# Altium project MCont_V1.0.PrjPcb (part 1 of 2)
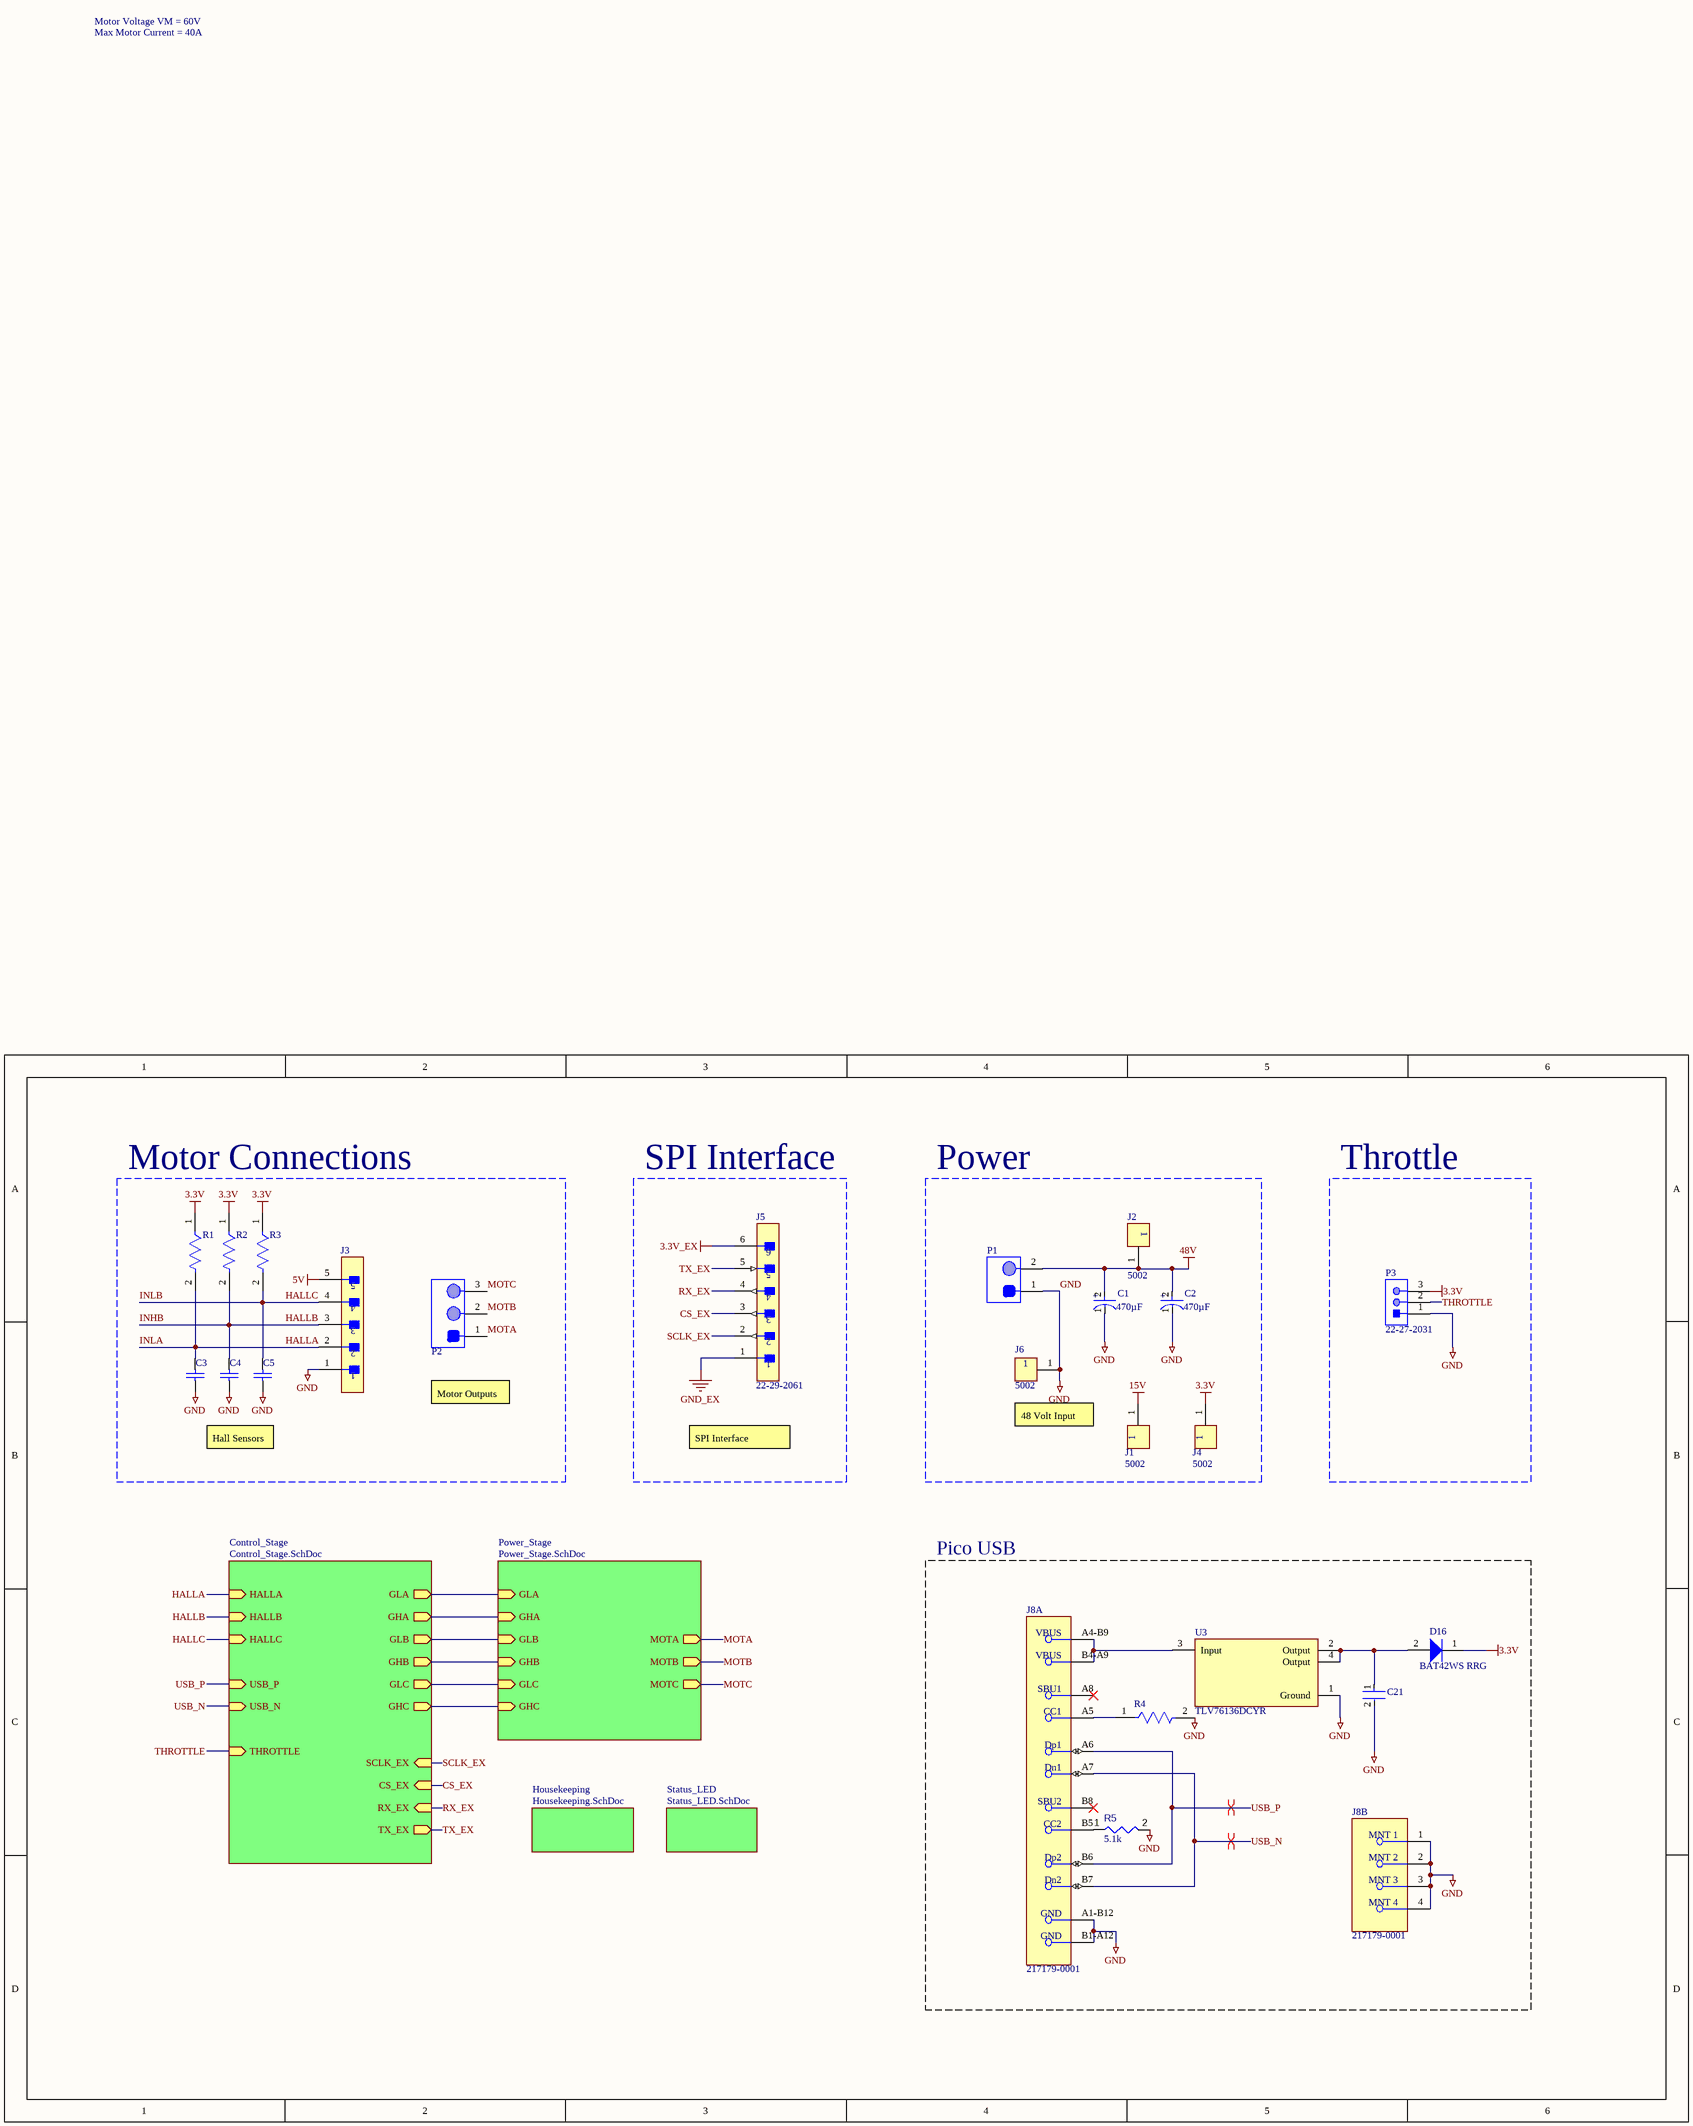
[diagram p0: MCont_V1.0.SchDoc]
5 sheets, 146 parts. Net scope: hierarchical (ports join the sheet entries above them; power ports are global).
Board file: MCont_V1.0.PcbDoc
Sheets:
  MCont_V1.0.SchDoc
    Housekeeping = Housekeeping.SchDoc
    Status_LED = Status_LED.SchDoc
    Power_Stage = Power_Stage.SchDoc
    Control_Stage = Control_Stage.SchDoc

## Sheet MCont_V1.0.SchDoc
size 381 x 241 mm; SheetNumber: 1; SheetTotal: 5

### Parts
C1  Capacitance: 470µF  [FP-ESH477M100AM2AA-MFG]  (hidden comment: ESH477M100AM2AA)
C2  Capacitance: 470µF  [FP-ESH477M100AM2AA-MFG]  (hidden comment: ESH477M100AM2AA)
C3  VJ0603Y102KXACW1BC  [CAPC1608X95X40NL15T15]  (value not drawn)
C4  VJ0603Y102KXACW1BC  [CAPC1608X95X40NL15T15]  (value not drawn)
C5  VJ0603Y102KXACW1BC  [CAPC1608X95X40NL15T15]  (value not drawn)
C21  CC0603KRX5R6BB106  [FP-CC0603-DC-MFG]  (value not drawn)
D16  BAT42WS RRG  [BAT42WS RRG-Footprint-1]
J1  5002  [FP-5002-MFG]
J2  5002  [FP-5002-MFG]
J3  22-29-2051  [FP-22-29-2051-MFG]  (value not drawn)
J4  5002  [FP-5002-MFG]
J5  22-29-2061  [FP-22-29-2061-MFG]
J6  5002  [FP-5002-MFG]
J8  217179-0001  [FP-2171790001-MFG]  (parts A,B of 2)
P1  VP0265540000G  [VP0265540000G-Footprint-1]  (value not drawn)
P2  VP0365540000G  [VP0365540000G-Footprint-1]  (value not drawn)
P3  22-27-2031  [MOLX-22-27-2031_V]
R1  RC0603FR-0710KL  [FP-RC0603-0_55-IPC_C]  (value not drawn)
R2  RC0603FR-0710KL  [FP-RC0603-0_55-IPC_C]  (value not drawn)
R3  RC0603FR-0710KL  [FP-RC0603-0_55-IPC_C]  (value not drawn)
R4  ERJ-3EKF5101V  [FP-ERJ3EK-MFG]  (value not drawn)
R5  value 5.1k  [FP-ERJ3EK-IPC_A]  (hidden comment: ERJ-3EKF5101V)
U3  TLV76136DCYR  [TLV76136DCYR-Footprint-1]

### Blocks framed on the sheet
Motor Connections: C3-C5 J3 P2 R1-R3
SPI Interface: J5
Power: C1 C2 J1 J2 J4 J6 P1
Throttle: P3
Pico USB: C21 D16 J8 R4 R5 U3

### Sub-sheets
Control_Stage = Control_Stage.SchDoc: HALLA (in), HALLB (in), HALLC (in), USB_P (in), USB_N (in), GLA (out), GHA (out), GLB (out), GHB (out), GLC (out), GHC (out), THROTTLE (in), SCLK_EX (in), CS_EX (in), RX_EX (in), TX_EX (out)
Housekeeping = Housekeeping.SchDoc: no entries
Power_Stage = Power_Stage.SchDoc: MOTA (out), MOTB (out), MOTC (out), GLA (in), GHA (in), GLB (in), GHB (in), GLC (in), GHC (in)
Status_LED = Status_LED.SchDoc: no entries

### Nets
3.3V: D16.1(K) J4.1 P3.3 R1.1 R2.1 R3.1
3.3V_EX: J5.6
5V: J3.5
15V: J1.1
48V: C1.2(A) C2.2(A) J2.1 P1.2
GND: C1.1(C) C2.1(C) C3.1 C4.1 C5.1 C21.2 J3.1 J6.1 J8.1(MNT_1) J8.2(MNT_2) J8.3(MNT_3) J8.4(MNT_4) J8.A1-B12(GND) J8.B1-A12(GND) P1.1 P3.1 R4.2 R5.2 U3.1(Ground)
GND_EX: J5.1
CS_EX: J5.3 ; sheet Control_Stage/CS_EX
GHA: sheet Power_Stage/GHA, sheet Control_Stage/GHA
GHB: sheet Power_Stage/GHB, sheet Control_Stage/GHB
GHC: sheet Power_Stage/GHC, sheet Control_Stage/GHC
GLA: sheet Power_Stage/GLA, sheet Control_Stage/GLA
GLB: sheet Power_Stage/GLB, sheet Control_Stage/GLB
GLC: sheet Power_Stage/GLC, sheet Control_Stage/GLC
HALLA: C3.2 J3.2 R1.2 ; sheet Control_Stage/HALLA  [also labelled INLA]
HALLB: C4.2 J3.3 R2.2 ; sheet Control_Stage/HALLB  [also labelled INHB]
HALLC: C5.2 J3.4 R3.2 ; sheet Control_Stage/HALLC  [also labelled INLB]
MOTA: P2.1 ; sheet Power_Stage/MOTA
MOTB: P2.2 ; sheet Power_Stage/MOTB
MOTC: P2.3 ; sheet Power_Stage/MOTC
RX_EX: J5.4 ; sheet Control_Stage/RX_EX
SCLK_EX: J5.2 ; sheet Control_Stage/SCLK_EX
THROTTLE: P3.2 ; sheet Control_Stage/THROTTLE
TX_EX: J5.5 ; sheet Control_Stage/TX_EX
USB_N: J8.A7(Dn1) J8.B7(Dn2) ; sheet Control_Stage/USB_N
USB_P: J8.A6(Dp1) J8.B6(Dp2) ; sheet Control_Stage/USB_P
NetC21_1: C21.1 D16.2(A) U3.2(Output) U3.4(Output)
NetJ8_A4-B9: J8.A4-B9(VBUS) J8.B4-A9(VBUS) U3.3(Input)
NetJ8_A5: J8.A5(CC1) R4.1
NetJ8_B5: J8.B5(CC2) R5.1

Not connected (* = marked no-connect by the designer): J8 A8(SBU1)* B8(SBU2)*

### Layout directives
differential pair: USB_N, USB_P

### Notes on the sheet
- Motor Voltage VM = 60V
- Max Motor Current = 40A
- Motor Outputs
- Hall Sensors
- SPI Interface
- 48 Volt Input
- (in symbol CMP-00212-26722299-1) +

### Library data of the parts
C1 C2 = CMP-00212-26722299-1: ESH477M100AM2AA Radial Can ALUMINUM ELECTROLYTIC CAPACITOR ESH 100V 470muF ±20% 0.630Dia 16.00mm; Life (Hours): 2000hours; Case/Package: Radial; Height: 32mm; REACH SVHC: No SVHC; Voltage Rating: 100V; Min Operating Temperature: -25°C; Diameter: 16mm; Voltage Rating (DC): 100V; Max Operating Temperature: 105°C; RoHS: Compliant; Packaging: Tape & Reel; Tolerance: 20%; Lead Pitch: 7.5mm; NexarPartId: 26722299
C3-C5 = CMP-2006-02121-1: Manufacturer: Vitramon; Part Number: VJ0603Y102KXACW1BC
C21 = CMP-03422-001507-1: CAP CER 10UF 10V X5R 0603; Tolerance: 10%; Case/Package: 0603; Length: 0.063inch; Capacitance: 10uF; Dielectric: X5R; Mount: Surface Mount; Case Code (Metric): 1608; Depth: 0.8mm; Voltage Rating (DC): 10V; Voltage Rating: 10V; Lead Free: Lead Free; Resistor Type: Ceramic; Packaging: Tape and Reel; Max Operating Temperature: 85°C; Termination: SMD/SMT; Min Operating Temperature: -55°C; Weight: 7.1E-05oz; Thickness: 0.035inch; Case Code (Imperial): 0603; Package Quantity: 4000; Halogen Free: Halogen Free; RoHS Compliant: Yes; Width: 0.031inch
D16 = CMP-004-00032-1: Schottky Diode, 30V, 0.2A, Sod-323F Rohs Compliant: Yes; Manufacturer Lifecycle Status: ACTIVE; Lifecycle Status: Production
J1 J2 J4 J6 = CMP-2000-05182-2: PC TEST POINT MINIATURE WHITE; Body Material: Bronze; Insulation: Insulated; Inside Diameter: 1.27mm; Number of Ports: 1; Outside Diameter: 2.54mm; Hole Diameter: 1.6mm; Plating: Silver; Contact Plating: Silver; Orientation: Straight; REACH SVHC: No SVHC; Series: THM; Packaging: Bulk; Material: Nylon; Flammability Rating: UL94 V-0; Mount: Through Hole; Color: White; Housing Color: White; Length: 7.62mm; Contact Material: Bronze; Lead Free: Lead Free; Package Quantity: 100; RoHS Compliant: Yes
J3 = CMP-04776-000816-1: 2.54MM KK HDR VT FRICLK VRA .5AU; Number of Circuits: 5; Connector Type: Male Pin; Max Current Rating: 7A; Glow Wire Compliant: Non-compliant; Insulation Resistance: 50GR; Gender: Male; Current Rating: 4A; Number of Lines: 1; Max Voltage Rating (AC): 250V; Contact Resistance: 10mR; Orientation: Straight; Height: 14.73mm; Contact Plating: Gold; Series: KK® 6410; Number of Poles: 5; Mount: Through Hole; Length: 12.7mm; Packaging: Bulk; Package Quantity: 10; Depth: 5.8mm; Housing Color: White; Pitch: 2.54mm; Number of Positions: 5; Contact Mating Length: 0.295inch; Max Operating Temperature: 75°C; Housing Material: Nylon; Termination: Solder; Contact Material: Brass; Flammability Rating: UL94 V-0; Number of Contacts: 5; Color: Natural; Min Operating Temperature: 0°C; Radiation Hardening: No; Contact Type: Male Pin; Number of Rows: 1; Voltage Rating: 250V; Voltage Rating (DC): 250V; Contact Gender: Male; Fastening Type: Friction; Lead Free: Lead Free; Halogen Free: Low Halogen
J5 = CMP-04776-000348-1: CONN HEADER VERT 6POS 2.54MM; Gender: Male; Number of Poles: 6; Voltage Rating: 250V; Insulation Resistance: 50GR; Contact Resistance: 10mR; Current Rating: 4A; Number of Lines: 1; Height: 11.7mm; Mount: Through Hole; Length: 15.24mm; Contact Plating: Gold; Contact Type: Male Pin; Contact Material: Brass; Housing Material: Nylon; Series: KK® 6410; Number of Positions: 6; Contact Mating Length: 0.295inch; Fastening Type: Friction; RoHS Compliant: Yes; Color: Natural; Max Operating Temperature: 75°C; Contact Gender: Male; Packaging: Bulk; Termination: Solder; Voltage Rating (DC): 250V; Orientation: Straight; Radiation Hardening: No; Flammability Rating: UL94 V-0; Package Quantity: 1000; Housing Color: White; Number of Rows: 1; Min Operating Temperature: 0°C; Max Current Rating: 4A; Pitch: 2.54mm; Depth: 5.8mm; Number of Contacts: 6; Lead Free: Lead Free
J8 = CMP-04767-000028-2: CONN RCP USB2.0 TYP C 24P SMD RA; NexarPartId: 117190526; Gender: Receptacle; Number of Contacts: 16; Current Rating: 1.25A; Voltage Rating: 30V; Min Operating Temperature: -40°C; USB Standard: USB 2.0; Height: 3.36mm; Contact Material: Gold, Nickel; Max Operating Temperature: 85°C
P1 = CMP-002-00073-1: VP10.16-2P slot screws Cr3+ zinc, solder foot bright tin, steel stamping clamp; RoHS Compliant: Yes
P2 = CMP-002-00077-2: VP10.16-3P slot screws Cr3 zinc, solder foot bright tin, steel stamping clamp; RoHS Compliant: Yes
P3 = CMP-2000-05538-1: Male Header, Pitch 2.54 mm, 1 x 3 Position, Height 11.7 mm, Tail Length 3.56 mm, -40 to 80 degC, RoHS, Bulk; Manufacturer: Molex; Voltage rating: 250V; Current rating: 4A; Package Reference: 22-27-2031; Housing material: Nylon(UL94V-0); Operating temperature: 0°Cto+75°C; Package Description: Male Header, Pitch 2.54 mm, 1 x 3 Position, Height 11.7 mm, Tail Length 3.56 mm; Package URL: http://www.molex.com/pdm_docs/sd/022272031_sd.pdf; Datasheet Version: 06/2016; Manufacturer URL: http://www.molex.com/; Mounting Technology: ThroughHole; Datasheet URL: http://www.molex.com/webdocs/datasheets/pdf/en-us/0022272031_PCB_HEADERS.pdf; Contact material: Tinplatedbrass
R1-R3 = CMP-2100-03664-2: RES 10K OHM 1% 1/10W 0603; Voltage Rating: 75V; Voltage Rating (DC): 50V; Resistance: 10kR; Power Rating: 100mW; Temperature Coefficient: 100ppm/°C; Depth: 0.8mm; Termination: SMD/SMT; Resistor Type: Thick Film; Series: RC; Construction: Rectangular; Features: Moisture Resistant; Packaging: Tape and Reel; Min Operating Temperature: -55°C; Number of Terminations: 2; Lead Pitch: 0.3mm; RoHS Compliant: Yes; Case/Package: 0603; Resistance Tolerance: 1%; Military Standard: Not; Weight: 7.1E-05oz; Number of Pins: 2; Tolerance: 1%; Length: 1.6mm; Case Code (Imperial): 0603; Lead Free: Lead Free; Width: 0.8mm; Max Power Dissipation: 100mW; Height: 0.45mm; Max Operating Temperature: 155°C; Case Code (Metric): 1608; Size Code: 0603
R4 = CMP-2000-00540-8: RES SMD 5.1K OHM 1% 1/10W 0603; Power Rating: 100mW; Temperature Coefficient: 100ppm/°C; Voltage Rating: 75V; Resistance: 5.1kR; Military Standard: Not; Case/Package: 0603; Packaging: Tape and Reel; Package Quantity: 1; Reach SVHC Compliant: Yes; Lead Free: Lead Free; Mount: Surface Mount; Size Code: 0603; Depth: 0.8mm; Resistance Tolerance: 1%; Number of Terminations: 2; Resistor Type: Thick Film; Width: 0.8mm; Construction: Rectangular; Series: ERJ; Radiation Hardening: No; Max Operating Temperature: 155°C; Features: Automotive AEC-Q200; Tolerance: 1%; Voltage Rating (DC): 75V; Length: 1.6mm; RoHS Compliant: Yes; Min Operating Temperature: -55°C; Case Code (Metric): 1608; Termination: SMD/SMT; Weight: 7.1E-05oz; Max Power Dissipation: 100mW; Contact Plating: Tin; Height: 0.022inch; Case Code (Imperial): 0603
R5 = CMP-009-00178-1: Fixed Resistor, Metal Glaze/thick Film, 0.1W, 5100ohm, 75V, 1% +/-Tol, 100ppm/Cel, Surface Mount, 0603; Power: 100mW; Case/Package: 0603; Tolerance: 1%; Min Operating Temperature: -55°C; Max Operating Temperature: 155°C; RoHS Compliant: Yes; Mounting Technology: Surface Mount; Pins: 2
U3 = CMP-019-00054-3: 1A 16V high-PSRR linear voltage regulator 4-SOT-223 -40 to 125; Manufacturer Lifecycle Status: ACTIVE; Length: 6.5mm; RoHS: Compliant; Thickness: 1.6mm; Width: 3.5mm; Case/Package: SOT-223; Lifecycle Status: Production; Pins: 4; Height: 1.8mm

## Sheet Housekeeping.SchDoc
size B; SheetNumber: 2; SheetTotal: 5
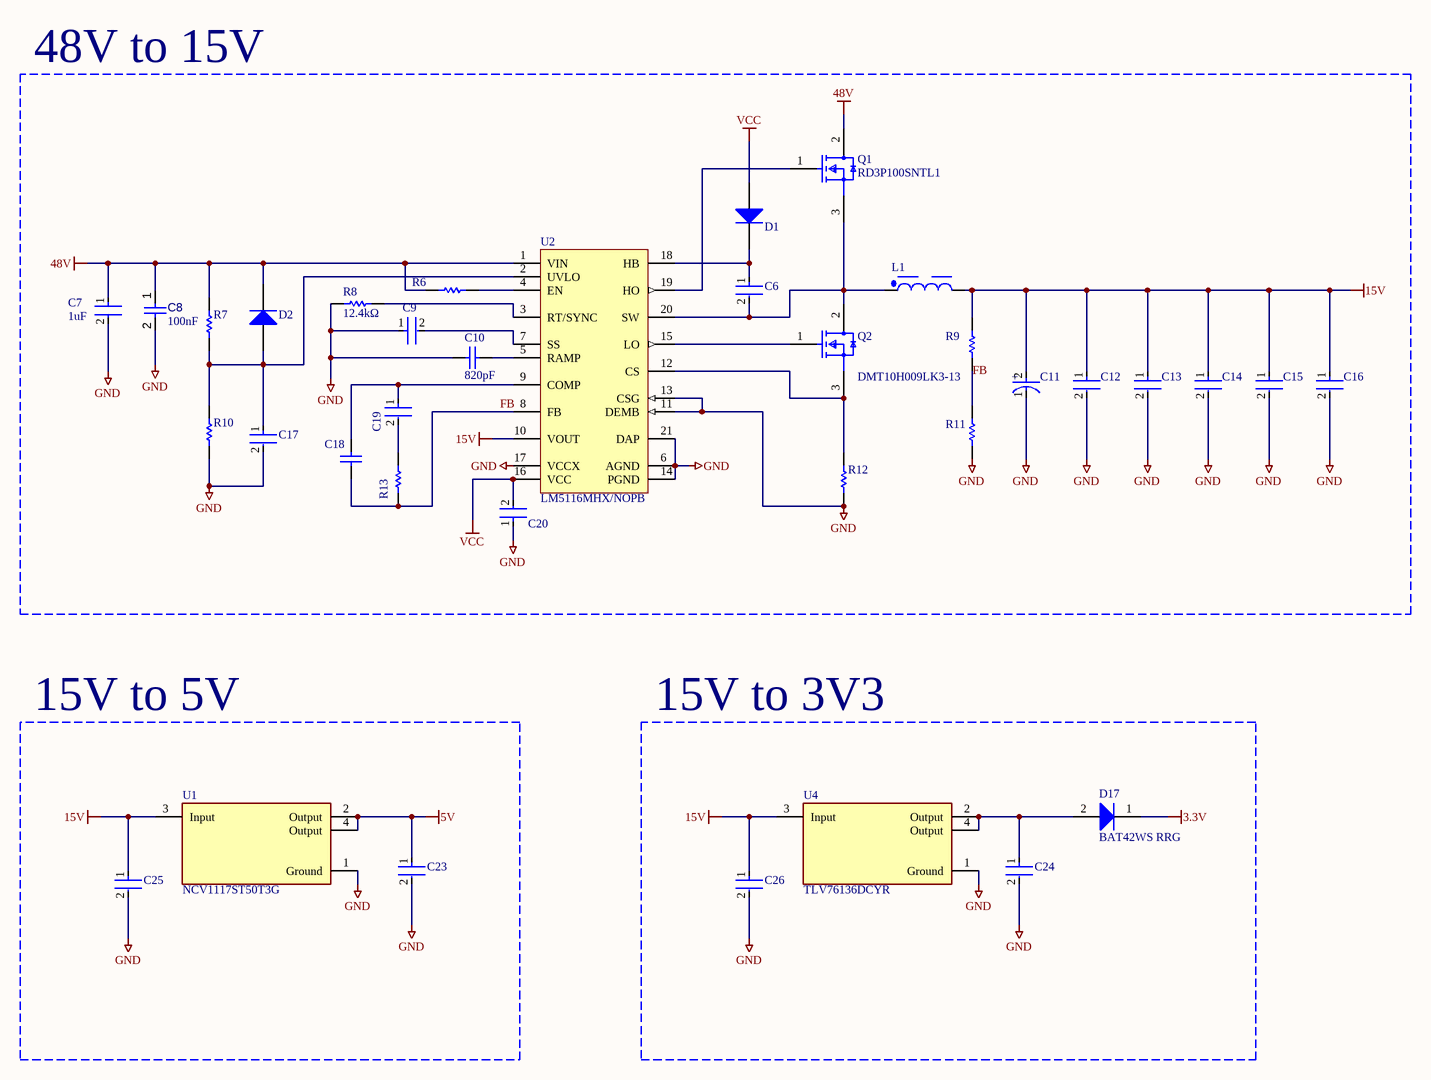
[diagram p1: Housekeeping.SchDoc]

### Parts
C6  UMK107AB7105KA-T  [FP-0603-L_1_6_0_15-W_0_8-IPC_C]  (value not drawn)
C7  Capacitance: 1uF  [FP-C1210C105K1RACTU-MFG]  (hidden comment: C1210C105K1RACTU)
C8  value 100nF  [FP-CL10-IPC_B]  (hidden comment: CL10B104KC8NNNC)
C9  CL10B104KC8NNNC  [FP-CL10-IPC_A]  (value not drawn)
C10  value 820pF  [0603N821J500CT-Footprint-1]  (hidden comment: 0603N821J500CT)
C11  50SVPF10M  [FP-OS-CON-SMT-C6-MFG]  (value not drawn)
C12  CL31A106KBHNNNE  [FP-CL31-IPC_C]  (value not drawn)
C13  CL31A106KBHNNNE  [FP-CL31-IPC_C]  (value not drawn)
C14  CL31A106KBHNNNE  [FP-CL31-IPC_C]  (value not drawn)
C15  CL31A106KBHNNNE  [FP-CL31-IPC_C]  (value not drawn)
C16  CL31A106KBHNNNE  [FP-CL31-IPC_C]  (value not drawn)
C17  UMK107AB7105KA-T  [FP-0603-L_1_6_0_15-W_0_8-IPC_C]  (value not drawn)
C18  CC0603JRNPO9BN101  [CAPC1608X90X40ML10T20]  (value not drawn)
C19  C0603C332J5RACTU  [FP-C0603C-CF-MFG]  (value not drawn)
C20  UMK107AB7105KA-T  [FP-0603-L_1_6_0_15-W_0_8-IPC_C]  (value not drawn)
C23  CC0603KRX5R6BB106  [FP-CC0603-DC-MFG]  (value not drawn)
C24  CC0603KRX5R6BB106  [FP-CC0603-DC-MFG]  (value not drawn)
C25  UMK107AB7105KA-T  [FP-0603-L_1_6_0_15-W_0_8-IPC_C]  (value not drawn)
C26  UMK107AB7105KA-T  [FP-0603-L_1_6_0_15-W_0_8-IPC_C]  (value not drawn)
D1  LL4148  [FAIR-SOD80-2_V]  (value not drawn)
D2  LL4148  [FAIR-SOD80-2_V]  (value not drawn)
D17  BAT42WS RRG  [BAT42WS RRG-Footprint-1]
L1  7447709390  [WE-PD_1210]  (value not drawn)
Q1  RD3P100SNTL1  [DPAK230P990X240-3N]
Q2  DMT10H009LK3-13  [DPAK229P991X239-3N]
R6  RC0603FR-071ML  [RESC1608X55X25LL10T15]  (value not drawn)
R7  ERJ-3EKF6192V  [RESC1608X55X30ML15T15]  (value not drawn)
R8  value 12.4kΩ  [FP-RC0603-0_55-IPC_C]  (hidden comment: RC0603FR-0712K4L)
R9  RC0603FR-0716K2L  [RESC1608X55X25NL10T15]  (value not drawn)
R10  ERJ-3EKF3921V  [RESC1608X55X30LL15T15]  (value not drawn)
R11  ERJ-3EKF1431V  [RESC1608X55X30ML15T15]  (value not drawn)
R12  ERJ8CWFR024V  [RESC3216X70X50NL05T20]  (value not drawn)
R13  ERJ3EKF1802V  [RESC1608X55X30LL15T15]  (value not drawn)
U1  NCV1117ST50T3G  [NCV1117ST50T3G-Footprint-1]
U2  LM5116MHX/NOPB  [PWP0020A_M]
U4  TLV76136DCYR  [TLV76136DCYR-Footprint-1]

### Blocks framed on the sheet
48V to 15V: C6-C20 D1 D2 L1 Q1 Q2 R6-R13 U2
15V to 5V: C23 C25 U1
15V to 3V3: C24 C26 D17 U4

### Nets
3.3V: D17.1(K)
5V: C23.1 U1.2(Output) U1.4(Output)
15V: C11.2(A) C12.1 C13.1 C14.1 C15.1 C16.1 C25.1 C26.1 L1.2 R9.2 U1.3(Input) U2.10(VOUT) U4.3(Input)
48V: C7.1 C8.1 D2.2(K) Q1.2 R6.1 R7.2 U2.1(VIN)
GND: C7.2 C8.2 C9.1 C10.1 C11.1(C) C12.2 C13.2 C14.2 C15.2 C16.2 C17.2 C20.1 C23.2 C24.2 C25.2 C26.2 R8.1 R10.1 R11.1 R12.1 U1.1(Ground) U2.6(AGND) U2.11(DEMB) U2.13(CSG) U2.14(PGND) U2.17(VCCX) U2.21(DAP) U4.1(Ground)
VCC: C20.2 D1.1(A) U2.16(VCC)
FB: C18.1 R9.1 R11.2 R13.1 U2.8(FB)
NetC6_1: C6.1 D1.2(K) U2.18(HB)
NetC6_2: C6.2 L1.1 Q1.3 Q2.2(D) U2.20(SW)
NetC9_2: C9.2 U2.7(SS)
NetC10_2: C10.2 U2.5(RAMP)
NetC17_1: C17.1 D2.1(A) R7.1 R10.2 U2.2(UVLO)
NetC18_2: C18.2 C19.1 U2.9(COMP)
NetC19_2: C19.2 R13.2
NetC24_1: C24.1 D17.2(A) U4.2(Output) U4.4(Output)
NetQ1_1: Q1.1(Gate) U2.19(HO)
NetQ2_1: Q2.1(G) U2.15(LO)
NetQ2_3: Q2.3(S) R12.2 U2.12(CS)
NetR6_2: R6.2 U2.4(EN)
NetR8_2: R8.2 U2.3(RT/SYNC)

### Notes on the sheet
- (in symbol CMP-05428-000804-1) +

### Library data of the parts
C6 C17 C20 C25 C26 = CMP-2000-07531-4: Ceramic Capacitor General Use 1uF ±10% 50V X7R 0603; Series: M; Width: 0.031inch; Mount: Surface Mount; Radiation Hardening: No; Voltage Rating (DC): 50V; Packaging: Tape and Reel; Termination: SMD/SMT; Depth: 0.8mm; Case Code (Metric): 1608; Case Code (Imperial): 0603; Height: 0.8mm; Voltage Rating: 50V; Package Quantity: 1; Halogen Free: Halogen Free; Dielectric: X7R; Min Operating Temperature: -55°C; Length: 1.6mm; Construction: Flat; Tolerance: 10%; Thickness: 0.037inch; Max Operating Temperature: 125°C; Case/Package: 0603; Capacitance: 1uF; RoHS Compliant: Yes
C7 = CMP-03020-034669-1: CAP CER 1UF 100V X7R 1210; Dielectric Material: Ceramic; Tolerance: 10%; Height: 1.7mm; Voltage Rating: 100V; Termination: SMD/SMT; Depth: 2.5mm; Construction: Flat; REACH SVHC: No SVHC; Length: 3.2mm; Case Code (Imperial): 1210; Radiation Hardening: No; Case/Package: 1210; Case Code (Metric): 3225; Mount: Surface Mount; Package Quantity: 1; Voltage Rating (DC): 100V; Min Operating Temperature: -55°C; Voltage: 100V; Thickness: 0.075inch; Width: 0.098inch; Max Operating Temperature: 125°C; Packaging: Tape and Reel; Series: C; RoHS Compliant: Yes; Number of Pins: 2; Dielectric: X7R
C8 = CMP-001-00090-1: Ceramic Capacitor, Multilayer, Ceramic, 100V, 10% +Tol, 10% -Tol, X7R, 15% TC, 0.1uF, Surface Mount, 0603; Case/Package: 0603; Min Operating Temperature: -55°C; Mounting Technology: Surface Mount; Capacitor Type: Ceramic; Max Operating Temperature: 125°C; Pins: 2; RoHS Compliant: Yes
C9 = CMP-13271-004036-1: Cap Ceramic 100nF 100V X7R ±10% Pad SMD 0603 +125°C T/R; Mount: Surface Mount; Packaging: Cut Tape; Width: 0.031inch; Thickness: 0.035inch; Length: 0.063inch; Tolerance: 10%; Min Operating Temperature: -55°C; Case/Package: 0603; Voltage Rating: 100V; Max Operating Temperature: 125°C; Case Code (Metric): 1608; Capacitance: 100nF; Case Code (Imperial): 0603
C10 = CMP-001-00084-2: 0603 Cap Ceramic 820pF 50V C0G 5% - Multilayer Ceramic Capacitors; Tolerance: 5%; Mounting Technology: Surface Mount; Max Operating Temperature: 125°C; Length: 1.6mm; Height: 800µm; Case/Package: 0603; Case Code (Imperial): 0603; Case Code (Metric): 1608; Number of Terminals: 2; Voltage Rating: 50V; Voltage Rating (DC): 50V; Dielectric: C0G; Radiation Hardening: No; Min Operating Temperature: -55°C; Dielectric Material: Ceramic; REACH SVHC: Yes; Lifecycle Status: Production; China RoHS: Compliant; Width: 800µm; RoHS: Compliant; Lead Free: Lead Free; Depth: 800µm
C11 = CMP-05428-000804-1: Conductive Polymer Aluminum Solid Capacitors (OS-CON) 10uF ±20% 50V; ESR (Equivalent Series Resistance): 40mR; Ripple Current: 2.5A; Leakage Current: 100uA; Life (Hours): 5000Hour; Dissipation Factor: 12%; Voltage Rating (DC): 50V; Termination: SMD/SMT; Voltage Rating: 50V; Voltage: 50V; Min Operating Temperature: -55°C; Max Operating Temperature: 105°C; Height - Seated (Max): 0.236inch; Case/Package: Radial; Mount: Surface Mount; Height: 5.9mm; RoHS Compliant: Yes; Diameter: 6.3mm; Construction: Cylindrical; Ripple Current (AC): 2.5A; Series: OS-CON, SVPF; Length: 5.9mm; Package Quantity: 1000; REACH SVHC: No SVHC; Number of Pins: 6; Capacitance: 10uF; Packaging: Tape and Reel; Lead Free: Lead Free; Tolerance: 20%
C12-C16 = CMP-13271-000016-1: CAP CER 10UF 50V X5R 1206; Manufacturer: Samsung; Tolerance: 10%; Material: Ceramic; Temperature Coefficient: 15%; RoHS: TRUE; Ipc Land Pattern Name: CAPC320160X160; Temperature Range Low: -55°C; Value: 10uF; Device Class L3: Ceramic Capacitors; Category: Cap; Temperature Characteristic: X5R; Lead Free: Yes; Device Class L2: Capacitors; Octopart: https://octopart.com/cl31a106kbhnnne-samsung-19832778; ComponentLink2Description: Datasheet; Digikey Description: CAP CER 10UF 50V X5R 1206; Voltage: 50V; ComponentLink2URL: http://www.samsungsem.com/kr/support/product-search/mlcc/__icsFiles/afieldfile/2018/06/21/CL31A106KBHNNNE.pdf; Capacitance: 10uF; Manufacturer Part Number: CL31A106KBHNNNE; Temperature Range High: +85°C; Device Class L1: Passive Components; Height: 1.8mm; Automotive: No; Voltage Rating: 50V; Package: CL31; Temperature: -55°C to +85°C
C18 = CMP-2100-03594-1: Chip Capacitor, 100 pF, +/- 5%, 50 V, -55 to 125 degC, 0603 (1608 Metric), RoHS, Tape and Reel; Manufacturer: Yageo; Capacitance: 100pF; Voltage Rating (DC): 50V; Dielectric: C0G; Temperature Coefficient: 30ppm/degC; Insulation Resistance: 100GR; Datasheet Version: Rev. 14, 07/2016; Manufacturer URL: http://www.yageo.com/; Packaging: TapeandReel; Mount: SurfaceMount; RoHSCompliant: True; Package Reference: 0603; Tolerance: 5%; Max Operating Temperature: 125degC; Case Code (Imperial): 0603; Number of Pins: 2; Width: 0.8mm; Case Code (Metric): 1608; Voltage: 50V; REACH SVHC: Unknown; Package Description: 2-Pin Surface Mount Device, Body 1.6 x 0.8 mm; Composition: Ceramic; Lead Free: LeadFree; Min Operating Temperature: -55degC; Radiation Hardening: No; Depth: 0.8mm; Thickness: 0.035inch; Datasheet URL: http://www.yageo.com/documents/recent/UPY-GP_NP0_16V-to-50V_14.pdf; Termination: SMD/SMT; Package Quantity: 1; Length: 1.6mm; Voltage Rating: 50V; Height: 0.8mm; Case/Package: 0603
C19 = CMP-2006-03174-2: CAP CER 3300PF 50V 5% X7R 0603; Manufacturer: KEMET; Automotive Grade: Grade 1; Material: Ceramic; Value: 3,300 pF; Temperature Coefficient: 30ppm/°C; Tolerance: 0.05; Temperature Range Low: -55°C; Device Class L3: Ceramic Capacitors; Temperature Characteristic: X7R; Temperature: -55°C to +125°C; Device Class L1: Passive Components; ComponentLink2URL: https://api.kemet.com/component-edge/download/datasheet/C0603C100J5GACAUTO.pdf; Automotive: Yes; Capacitance: 3,300 pF; RoHS: TRUE; Mouser Description: Multilayer Ceramic Capacitors MLCC - SMD/SMT 50volts 3300pF X7R 5%; Height: 0.87mm; Manufacturer Part Number: C0603C332J5RACTU; Temperature Range High: +125°C; ComponentLink2Description: Datasheet; Voltage Rating: 50 V; Octopart: https://octopart.com/c0603c332j5ractu-kemet-9139905; Package: C0603C-CF; Lead Free: Yes; Device Class L2: Capacitors; Digikey Description: CAP CER 3300PF 50V 5% X7R 0603; Category: Cap
C23 C24 = CMP-03422-001507-1: as C21 on sheet MCont_V1.0; Case/Package: 0603; Length: 0.063inch; Capacitance: 10uF; Dielectric: X5R; Mount: Surface Mount; Case Code (Metric): 1608; Depth: 0.8mm; Voltage Rating (DC): 10V; Voltage Rating: 10V; Lead Free: Lead Free; Resistor Type: Ceramic; Packaging: Tape and Reel; Max Operating Temperature: 85°C; Termination: SMD/SMT; Min Operating Temperature: -55°C; Weight: 7.1E-05oz; Thickness: 0.035inch; Case Code (Imperial): 0603; Package Quantity: 4000; Halogen Free: Halogen Free; RoHS Compliant: Yes; Width: 0.031inch
D1 D2 = CMP-2000-05115-2: Small Signal Diode, 100 V, 0.2 A, -55 to 175 degC, 2-Pin SOD80, RoHS, Tape and Reel; Manufacturer: Fairchild; Reverse Voltage-Max [Vrrm]: 100V; Average Forward Current-Max: 200mA; Forward Voltage: 1V; Reverse Recovery Time-Max: 1ns; Power Dissipation: 500mW; Datasheet URL: https://www.fairchildsemi.com/datasheets/LL/LL4148.pdf; Manufacturer URL: https://www.fairchildsemi.com/; Datasheet Version: Rev. 1.8, 01/2016
D17 = CMP-004-00032-1: as D16 on sheet MCont_V1.0; Lifecycle Status: Production
L1 = CMP-0227-00184-3: High Current Inductor, Fixed, 1210, 39 Uh, 4.1 A, .056 Ohm, We-pd Series; Inductance: 39µH; RMS Current (Irms): 4.1A; Saturation Current: 5A; Tolerance: 20%; Core Material: Ferrite; Series Resistance: 56mΩ; Self Resonant Frequency: 6MHz; DC Resistance (DCR): 44mΩ; Test Frequency: 1kHz; Shielding: Shielded; Max Operating Temperature: 125°C; RoHS: Compliant; Case/Package: Nonstandard; Height - Seated (Max): 10.0076mm; Number of Pins: 2; REACH SVHC: Unknown; Height: 10mm; Mount: Surface Mount; Ambient Temperature Range Low: -40°C; Case Code (Metric): 3225; Lead Pitch: 7mm; Current Rating: 4.1A; Min Operating Temperature: -40°C; Width: 12mm; Composition: Wirewound; Max DC Current: 4.1A; Case Code (Imperial): 1210; Inductance Tolerance: 20%; Lead Free: Lead Free; Termination: SMD/SMT; Depth: 12mm; Ambient Temperature Range High: 85°C; Length: 12mm
Q1 = CMP-013-00035-2: Transistor MOSFET N-CH 100V 10A 3-Pin TO-252 Emboss T/R; Number of Elements: 1; Drain to Source Resistance: 147mΩ; Min Breakdown Voltage: 100V; Continuous Drain Current (ID): 10A; RoHS: Compliant; REACH SVHC: No; Lifecycle Status: Production; Number of Terminals: 2; Mounting Technology: Surface Mount
Q2 = CMP-013-00037-2: DMT10H009LK3 series N-Channel Mosfet 100V 90A TO252 (DPAK); Number of Elements: 1; Drain to Source Resistance: 9mΩ; Max Power Dissipation: 3W; China RoHS: Non-Compliant; Lifecycle Status: Production; Military Standard: MIL-STD-202; Min Operating Temperature: -55°C; REACH SVHC: No; Continuous Drain Current (ID): 90A; Number of Terminals: 2; Min Breakdown Voltage: 100V; RoHS: Compliant; Max Operating Temperature: 150°C
R6 = CMP-1659-00056-1: Chip Resistor, 1 MOhm, +/- 1%, 100 mW, -55 to 155 degC, 0603 (1608 Metric), RoHS, Tape and Reel; Voltage Rating (DC): 25 V; Tolerance: 20%; Case\Package: Radial; Capacitance: 1 mF; Min Operating Temperature: -40 degC; PackageDescription: 2-Pin Surface Mount Device, Body 1.6 x 0.8 mm; ComponentLink1Description: Manufacturer URL; Radiation Hardening: No; DatasheetVersion: Rev. 4, 02/2016; REACH SVHC: No SVHC; Length: 20 mm; Max Operating Temperature: 85 degC; Diameter: 10 mm; Packaging: Bulk; Package Quantity: 200; PackageReference: 0603; Mount: Through Hole; ComponentLink1URL: http://www.yageo.com/; ComponentLink2URL: http://www.yageo.com/documents/recent/PYu-RC_Group_51_RoHS_L_04.pdf; ComponentLink2Description: Datasheet; Width: 0 inch; Lead Pitch: 5 mm; RoHSCompliant: true; Voltage Rating: 25 V; Height: 20 mm
R7 = CMP-2000-00591-1: Manufacturer: Panasonic; Part Number: ERJ-3EKF6192V
R8 = CMP-009-00181-1: 100mW Thick Film Resistors 75V ±100ppm/℃ ±1% 12.4kΩ 0603 Chip Resistor - Surface Mount ROHS; Temperature Coefficient: 100ppm/°C; Voltage Rating (DC): 50V; Number of Terminals: 2; REACH SVHC: Yes; Depth: 800µm; Min Operating Temperature: -55°C; Max Operating Temperature: 155°C; Termination: SMD/SMT; Mounting Technology: Surface Mount; Width: 800µm; Features: Moisture Resistant; Composition: Thick Film; Working Voltage: 75V; Number of Terminations: 2; Voltage Rating: 75V; Height: 450µm; Case/Package: 0603; Lead Free: Lead Free; China RoHS: Non-Compliant; Tolerance: 1%; Case Code (Imperial): 0603; RoHS: Compliant; Power Dissipation: 100mW; Military Standard: Not; Power Rating: 100mW; Lifecycle Status: Production; Packaging: Tape & Reel; Max Power Dissipation: 100mW; Schedule B: 8533210045, 8533210045; Length: 1.6002mm
R9 = CMP-1012-00645-2: Manufacturer: Yageo; Part Number: RC0603FR-0716K2L
R10 = CMP-2000-00479-1: Manufacturer: Panasonic; Part Number: ERJ-3EKF3921V
R11 = CMP-2000-00250-1: Manufacturer: Panasonic; Part Number: ERJ-3EKF1431V
R12 = CMP-2003-00795-1: Manufacturer: Panasonic; Part Number: ERJ8CWFR024V
R13 = CMP-1012-00650-3: Fixed Resistor, Metal Glaze/thick Film, 0.1W, 18000ohm, 75V, 1% +/-Tol, 100ppm/Cel, Surface Mount, 0603; Manufacturer: Panasonic; Part Number: ERJ3EKF1802V
U1 = CMP-019-00053-2: IC REG LDO 5V 1A SOT223 / LDO Regulator Pos 5V 1A Automotive 4-Pin(3+Tab) SOT-223 T/R
U2 = CMP-0069-01482-3: Wide Range Synchronous Buck Controller, 20-pin TSSOP-EP, Pb-Free; Manufacturer: Texas Instruments; PackageTopMarking: NSUZXYTT*LM5116*MH; PowerWise: Y; CompType: Switcher; ComponentLink1URL: http://www.ti.com/general/docs/lit/getliterature.tsp?genericPartNumber=LM5116&fileType=pdf; PackageReference: PWP0020A; RoHS: Y; PinCount: 20; Code_JEDEC: MO-153-ACT; PackageDescription: Molded TSSOP, Jedec, 6.5 x 4.4 x 0.9mm Body, 20 Lead, 0.65mm Pitch, Exposed Pad; ComponentLink1Description: Datasheet URL
U4 = CMP-019-00054-3: as U3 on sheet MCont_V1.0; Length: 6.5mm; RoHS: Compliant; Thickness: 1.6mm; Width: 3.5mm; Case/Package: SOT-223; Lifecycle Status: Production; Pins: 4; Height: 1.8mm

## Sheet Status_LED.SchDoc
size A; SheetNumber: 3; SheetTotal: 5
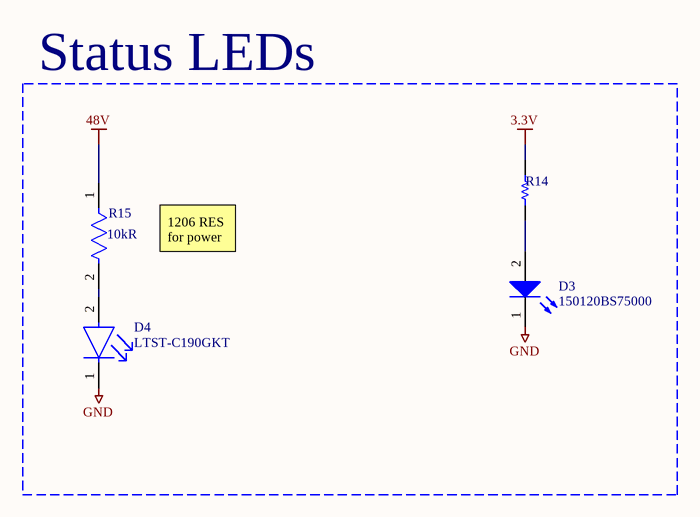
[diagram p2: Status_LED.SchDoc]

### Parts
D3  150120BS75000  [WL-SMCW_1206_150120xx75000]
D4  LTST-C190GKT  [FP-LTST-C190GKT-MFG]
R14  ERA3AEB301V  [RESC1608X55X30LL20T20]  (value not drawn)
R15  Resistance: 10kR  [FP-RK73H2B-IPC_C]  (hidden comment: RK73H2BTTDD1002F)

### Blocks framed on the sheet
Status LEDs: D3 D4 R14 R15

### Nets
3.3V: R14.1
48V: R15.1
GND: D3.1(K) D4.1(C)
NetD3_2: D3.2(A) R14.2
NetD4_2: D4.2(A) R15.2

### Notes on the sheet
- 1206 RES for power

### Library data of the parts
D3 = CMP-1426-00015-3: WL-SMCW SMT Mono-Color Chip LED Waterclear; Manufacturer Package Identifier: LED_1206; Dominant Wavelength: 470nm; Lens Style: Clear, Rectangular; Test Current: 20mA; Forward Voltage: 3.2V; Forward Current: 100mA; Peak Wavelength: 465nm; Max Reverse Voltage (DC): 5V; Viewing Angle: 140°; Color: Blue; Luminous Intensity: 145mcd; Max Operating Temperature: 85°C; Case Code (Imperial): 1206; Length: 3.2mm; Width: 1.6mm; Min Operating Temperature: -40°C; Height: 680µm; Case Code (Metric): 3216; Packaging: Tape and Reel; RoHS: Compliant; Case/Package: 1206; REACH SVHC: Unknown; Wavelength: 470nm; Mount: Surface Mount
D4 = CMP-22017-000005-2: LED GREEN CLEAR CHIP SMD; Dominant Wavelength: 569nm; Reverse Voltage: 5V; Lens Color: Colorless; Viewing Angle: 130°; Voltage: 2V; Forward Current: 30mA; Power Dissipation: 100mW; Luminous Intensity: 6mcd; Number of LEDs: 1; Forward Voltage: 2.1V; Wavelength: 565nm; Test Current: 10mA; Min Operating Temperature: -55°C; Lens Style: Clear; Mount: Surface Mount; Width: 0.8mm; Packaging: Tape and Reel; Lens Transparency: Clear; Case Code (Metric): 1608; Depth: 0.8mm; Case Code (Imperial): 0603; Case/Package: 0603; Number of Pins: 2; Max Operating Temperature: 85°C; Lead Free: Lead Free; Number of Elements: 1; Length: 1.6mm; Height: 0.8mm; Package Quantity: 1; Power Rating: 100mW; Radiation Hardening: No; Illumination Color: Green; Color: Green
R14 = CMP-2000-00025-1: Manufacturer: Panasonic; Part Number: ERA3AEB301V
R15 = CMP-2003-01644-2: 10kΩ ±1% 0.25W Chip Resistor 1206 Thick Film AEC-Q200 Qualified; Voltage Rating: 200V; Temperature Coefficient: 100ppm/°C; Power Rating: 250mW; Max Operating Temperature: 155°C; Min Operating Temperature: -55°C; Case/Package: Molded; Case Code (Imperial): 1206; RoHS Compliant: Yes; Packaging: Tape and Reel; Series: RK73H; Lead Free: Lead Free; Voltage Rating (DC): 200V; Tolerance: 1%; Termination: SMD/SMT; Case Code (Metric): 3216

## Sheet Power_Stage.SchDoc
size A2; SheetNumber: 4; SheetTotal: 5
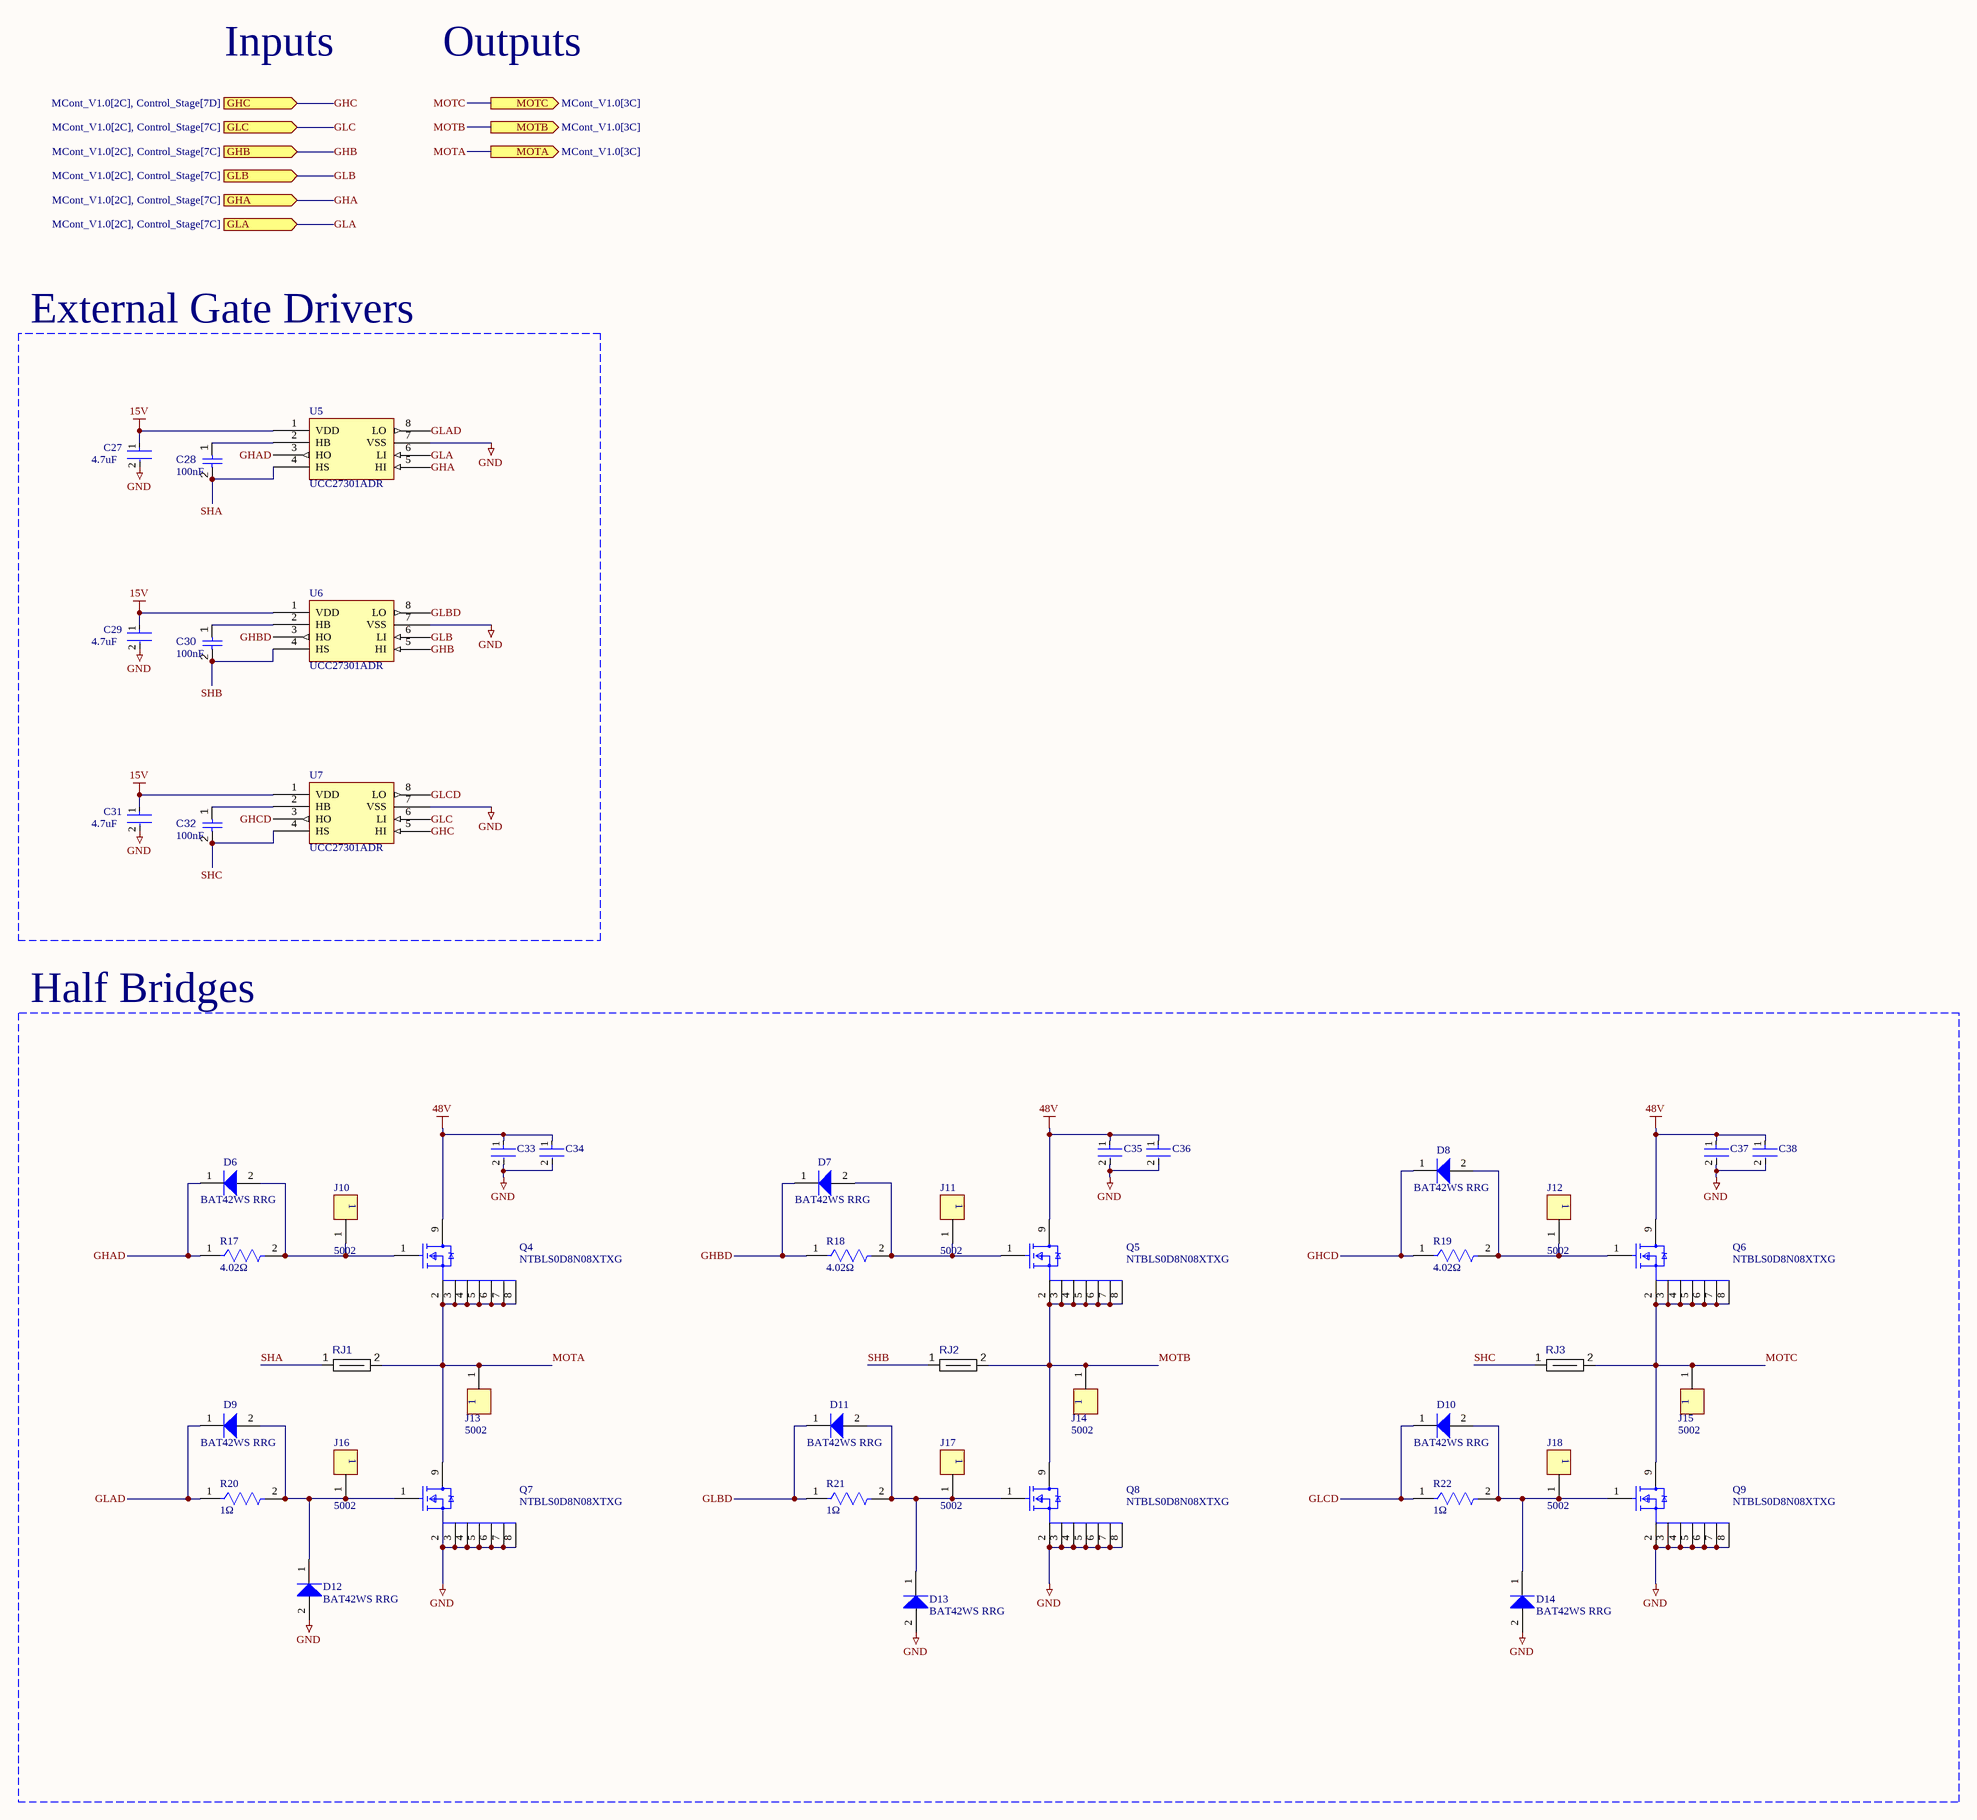
[diagram p3: Power_Stage.SchDoc]

### Parts
C27  Capacitance: 4.7uF  [FP-CL21-IPC_A]  (hidden comment: CL21A475KAQNNNE)
C28  value 100nF  [FP-CL10-IPC_B]  (hidden comment: CL10B104KC8NNNC)
C29  Capacitance: 4.7uF  [FP-CL21-IPC_A]  (hidden comment: CL21A475KAQNNNE)
C30  value 100nF  [FP-CL10-IPC_B]  (hidden comment: CL10B104KC8NNNC)
C31  Capacitance: 4.7uF  [FP-CL21-IPC_A]  (hidden comment: CL21A475KAQNNNE)
C32  value 100nF  [FP-CL10-IPC_B]  (hidden comment: CL10B104KC8NNNC)
C33  C1210C105K1RACTU  [FP-C1210C105K1RACTU-MFG]  (value not drawn)
C34  C1210C105K1RACTU  [FP-C1210C105K1RACTU-MFG]  (value not drawn)
C35  C1210C105K1RACTU  [FP-C1210C105K1RACTU-MFG]  (value not drawn)
C36  C1210C105K1RACTU  [FP-C1210C105K1RACTU-MFG]  (value not drawn)
C37  C1210C105K1RACTU  [FP-C1210C105K1RACTU-MFG]  (value not drawn)
C38  C1210C105K1RACTU  [FP-C1210C105K1RACTU-MFG]  (value not drawn)
D6  BAT42WS RRG  [BAT42WS RRG-Footprint-1]
D7  BAT42WS RRG  [BAT42WS RRG-Footprint-1]
D8  BAT42WS RRG  [BAT42WS RRG-Footprint-1]
D9  BAT42WS RRG  [BAT42WS RRG-Footprint-1]
D10  BAT42WS RRG  [BAT42WS RRG-Footprint-1]
D11  BAT42WS RRG  [BAT42WS RRG-Footprint-1]
D12  BAT42WS RRG  [BAT42WS RRG-Footprint-1]
D13  BAT42WS RRG  [BAT42WS RRG-Footprint-1]
D14  BAT42WS RRG  [BAT42WS RRG-Footprint-1]
J10  5002  [FP-5002-MFG]
J11  5002  [FP-5002-MFG]
J12  5002  [FP-5002-MFG]
J13  5002  [FP-5002-MFG]
J14  5002  [FP-5002-MFG]
J15  5002  [FP-5002-MFG]
J16  5002  [FP-5002-MFG]
J17  5002  [FP-5002-MFG]
J18  5002  [FP-5002-MFG]
Q4  NTBLS0D8N08XTXG  [NTBLS0D8N08XTXG]
Q5  NTBLS0D8N08XTXG  [NTBLS0D8N08XTXG]
Q6  NTBLS0D8N08XTXG  [NTBLS0D8N08XTXG]
Q7  NTBLS0D8N08XTXG  [NTBLS0D8N08XTXG]
Q8  NTBLS0D8N08XTXG  [NTBLS0D8N08XTXG]
Q9  NTBLS0D8N08XTXG  [NTBLS0D8N08XTXG]
R17  value 4.02Ω  [CRCW06034R02FKEAHP-Footprint-1]  (hidden comment: CRCW06034R02FKEAHP)
R18  value 4.02Ω  [CRCW06034R02FKEAHP-Footprint-1]  (hidden comment: CRCW06034R02FKEAHP)
R19  value 4.02Ω  [CRCW06034R02FKEAHP-Footprint-1]  (hidden comment: CRCW06034R02FKEAHP)
R20  value 1Ω  [SR0603FR-7T1RL-Footprint-1]  (hidden comment: SR0603FR-7T1RL)
R21  value 1Ω  [SR0603FR-7T1RL-Footprint-1]  (hidden comment: SR0603FR-7T1RL)
R22  value 1Ω  [SR0603FR-7T1RL-Footprint-1]  (hidden comment: SR0603FR-7T1RL)
RJ1  Net Tie 30x70mil  [Net Tie 10x20mil-Footprint-1]  (value not drawn)  (net tie, no BOM)
RJ2  Net Tie 30x70mil  [Net Tie 10x20mil-Footprint-1]  (value not drawn)  (net tie, no BOM)
RJ3  Net Tie 30x70mil  [Net Tie 10x20mil-Footprint-1]  (value not drawn)  (net tie, no BOM)
U5  UCC27301ADR  [SOIC127P600X175-8N]
U6  UCC27301ADR  [SOIC127P600X175-8N]
U7  UCC27301ADR  [SOIC127P600X175-8N]

### Blocks framed on the sheet
External Gate Drivers: C27-C32 U5-U7
Half Bridges: C33-C38 D6-D14 J10-J18 Q4-Q9 R17-R22 RJ1-RJ3

### Ports
GHA (in, see MCont_V1.0[2C], Control_Stage[7C]), GHB (in, see MCont_V1.0[2C], Control_Stage[7C]), GHC (in, see MCont_V1.0[2C], Control_Stage[7D]), GLA (in, see MCont_V1.0[2C], Control_Stage[7C]), GLB (in, see MCont_V1.0[2C], Control_Stage[7C]), GLC (in, see MCont_V1.0[2C], Control_Stage[7C]), MOTA (out, see MCont_V1.0[3C]), MOTB (out, see MCont_V1.0[3C]), MOTC (out, see MCont_V1.0[3C])

### Nets
15V: C27.1 C29.1 C31.1 U5.1(VDD) U6.1(VDD) U7.1(VDD)
48V: C33.1 C34.1 C35.1 C36.1 C37.1 C38.1 Q4.9(Drain) Q5.9(Drain) Q6.9(Drain)
GND: C27.2 C29.2 C31.2 C33.2 C34.2 C35.2 C36.2 C37.2 C38.2 D12.2(A) D13.2(A) D14.2(A) Q7.2(Source) Q7.3(Source) Q7.4(Source) Q7.5(Source) Q7.6(Source) Q7.7(Source) Q7.8(Source) Q8.2(Source) Q8.3(Source) Q8.4(Source) Q8.5(Source) Q8.6(Source) Q8.7(Source) Q8.8(Source) Q9.2(Source) Q9.3(Source) Q9.4(Source) Q9.5(Source) Q9.6(Source) Q9.7(Source) Q9.8(Source) U5.7(VSS) U6.7(VSS) U7.7(VSS)
GHA: U5.5(HI) ; port GHA
GHAD: D6.1(K) R17.1 U5.3(HO)
GHB: U6.5(HI) ; port GHB
GHBD: D7.1(K) R18.1 U6.3(HO)
GHC: U7.5(HI) ; port GHC
GHCD: D8.1(K) R19.1 U7.3(HO)
GLA: U5.6(LI) ; port GLA
GLAD: D9.1(K) R20.1 U5.8(LO)
GLB: U6.6(LI) ; port GLB
GLBD: D11.1(K) R21.1 U6.8(LO)
GLC: U7.6(LI) ; port GLC
GLCD: D10.1(K) R22.1 U7.8(LO)
MOTA: J13.1 Q4.2(Source) Q4.3(Source) Q4.4(Source) Q4.5(Source) Q4.6(Source) Q4.7(Source) Q4.8(Source) Q7.9(Drain) RJ1.2 ; port MOTA
MOTB: J14.1 Q5.2(Source) Q5.3(Source) Q5.4(Source) Q5.5(Source) Q5.6(Source) Q5.7(Source) Q5.8(Source) Q8.9(Drain) RJ2.2 ; port MOTB
MOTC: J15.1 Q6.2(Source) Q6.3(Source) Q6.4(Source) Q6.5(Source) Q6.6(Source) Q6.7(Source) Q6.8(Source) Q9.9(Drain) RJ3.2 ; port MOTC
SHA: C28.2 RJ1.1 U5.4(HS)
SHB: C30.2 RJ2.1 U6.4(HS)
SHC: C32.2 RJ3.1 U7.4(HS)
NetC28_1: C28.1 U5.2(HB)
NetC30_1: C30.1 U6.2(HB)
NetC32_1: C32.1 U7.2(HB)
NetD6_2: D6.2(A) J10.1 Q4.1(Gate) R17.2
NetD7_2: D7.2(A) J11.1 Q5.1(Gate) R18.2
NetD8_2: D8.2(A) J12.1 Q6.1(Gate) R19.2
NetD9_2: D9.2(A) D12.1(K) J16.1 Q7.1(Gate) R20.2
NetD10_2: D10.2(A) D14.1(K) J18.1 Q9.1(Gate) R22.2
NetD11_2: D11.2(A) D13.1(K) J17.1 Q8.1(Gate) R21.2

### Notes on the sheet
- Inputs
- Outputs

### Library data of the parts
C27 C29 C31 = CMP-13271-002624-1: CL21 Series 0805 4.7uF 25V ±10% Tolerance X5R Multilayer Ceramic Chip Capacitor; Case Code (Imperial): 0805; Thickness: 0.055inch; Mount: Surface Mount; Case Code (Metric): 2012; Depth: 1.25mm; Lead Free: Lead Free; Case/Package: 0805; Voltage Rating: 25V; Package Quantity: 1; Width: 0.049inch; Radiation Hardening: No; Voltage Rating (DC): 25V; Length: 2mm; Dielectric: X5R; Height: 1.25mm; Packaging: Tape and Reel; Tolerance: 10%; Min Operating Temperature: -55°C; Max Operating Temperature: 85°C
C28 C30 C32 = CMP-001-00090-1: as C8 on sheet Housekeeping; Case/Package: 0603; Min Operating Temperature: -55°C; Mounting Technology: Surface Mount; Capacitor Type: Ceramic; Max Operating Temperature: 125°C; Pins: 2; RoHS Compliant: Yes
C33-C38 = CMP-03020-034669-1: as C7 on sheet Housekeeping; Capacitance: 1uF; Height: 1.7mm; Voltage Rating: 100V; Termination: SMD/SMT; Depth: 2.5mm; Construction: Flat; REACH SVHC: No SVHC; Length: 3.2mm; Case Code (Imperial): 1210; Radiation Hardening: No; Case/Package: 1210; Case Code (Metric): 3225; Mount: Surface Mount; Package Quantity: 1; Voltage Rating (DC): 100V; Min Operating Temperature: -55°C; Voltage: 100V; Thickness: 0.075inch; Width: 0.098inch; Max Operating Temperature: 125°C; Packaging: Tape and Reel; Series: C; RoHS Compliant: Yes; Number of Pins: 2; Dielectric: X7R
D6-D14 = CMP-004-00032-1: as D16 on sheet MCont_V1.0; Lifecycle Status: Production
J10-J18 = CMP-2000-05182-2: as J1 on sheet MCont_V1.0; Contact Plating: Silver; Orientation: Straight; REACH SVHC: No SVHC; Series: THM; Packaging: Bulk; Material: Nylon; Flammability Rating: UL94 V-0; Mount: Through Hole; Color: White; Housing Color: White; Length: 7.62mm; Contact Material: Bronze; Lead Free: Lead Free; Package Quantity: 100; RoHS Compliant: Yes
Q4-Q9 = CMP-013-00034-1: NTBL Series N-Channel 457A 325W Surface Mount Power Mosfet HPSOF-8; Manufacturer Lifecycle Status: ACTIVE; Lifecycle Status: Production; REACH SVHC: No; RoHS: Compliant
R17-R19 = CMP-009-00185-1: Res Thick Film 0603 4.02 Ohm 1% 0.33W(1/3W) ±100ppm/C Pad SMD Automotive T/R; Max Power Dissipation: 250mW; Voltage Rating: 75V; Power Dissipation: 330mW; Temperature Coefficient: 100ppm/°C; Tolerance: 1%; Packaging: Tape & Reel (TR); Number of Terminals: 2; Composition: Thick Film; REACH SVHC: Yes; Mounting Technology: Surface Mount; Lifecycle Status: Production; Length: 1.6002mm; Features: Automotive AEC-Q200; China RoHS: Non-Compliant; Export Control Classification Number (ECCN) Code: EAR99; Power Rating: 330mW; Introduction Date: 2008-07-29; Min Operating Temperature: -55°C; Harmonized Tariff Schedule (HTS) Code: 8533.21.00.30; Case Code (Metric): 1608; Height: 450µm; RoHS: Compliant; Case Code (Imperial): 0603; Contact Plating: Tin; Working Voltage: 75V; Case/Package: 0603; Number of Terminations: 2; Radiation Hardening: No; Lead Free: Lead Free; Width: 850µm; Max Operating Temperature: 155°C; Schedule B: 8533210045, 8533210045
R20-R22 = CMP-009-00184-1: Res Thick Film 0603 1 Ohm 1% 0.25W(1/4W) ±200ppm/C Pad SMD Automotive T/R; Working Voltage: 150V; Power Dissipation: 250mW; Temperature Coefficient: 200ppm/°C; Export Control Classification Number (ECCN) Code: EAR99; Harmonized Tariff Schedule (HTS) Code: 8533.21.00.30; Max Operating Temperature: 155°C; Mounting Technology: Surface Mount; Lifecycle Status: Production; Min Operating Temperature: -55°C; Height: 450µm; Introduction Date: 2017-10-02; Number of Terminals: 2; Width: 800µm; RoHS: Compliant; China RoHS: Non-Compliant; Case/Package: 0603; Tolerance: 1%; REACH SVHC: Yes; Packaging: Tape & Reel
RJ1-RJ3 = CMP-009-00182-13
U5-U7 = CMP-024-00000-1: 120V 4.5A half-bridge driver with 8V UVLO, interlock, and enable options 8-SOIC -40 to 150; Manufacturer Lifecycle Status: ACTIVE; Lifecycle Status: Production; RoHS: Compliant; Length: 4.9mm; Width: 3.91mm; Pins: 8; Height: 1.75mm; Thickness: 1.58mm; Case/Package: SOIC